# Altium schematic sheet Analog_Frontend02.SchDoc
size A4; DocumentNumber: 3; SheetNumber: 2; SheetTotal: 5
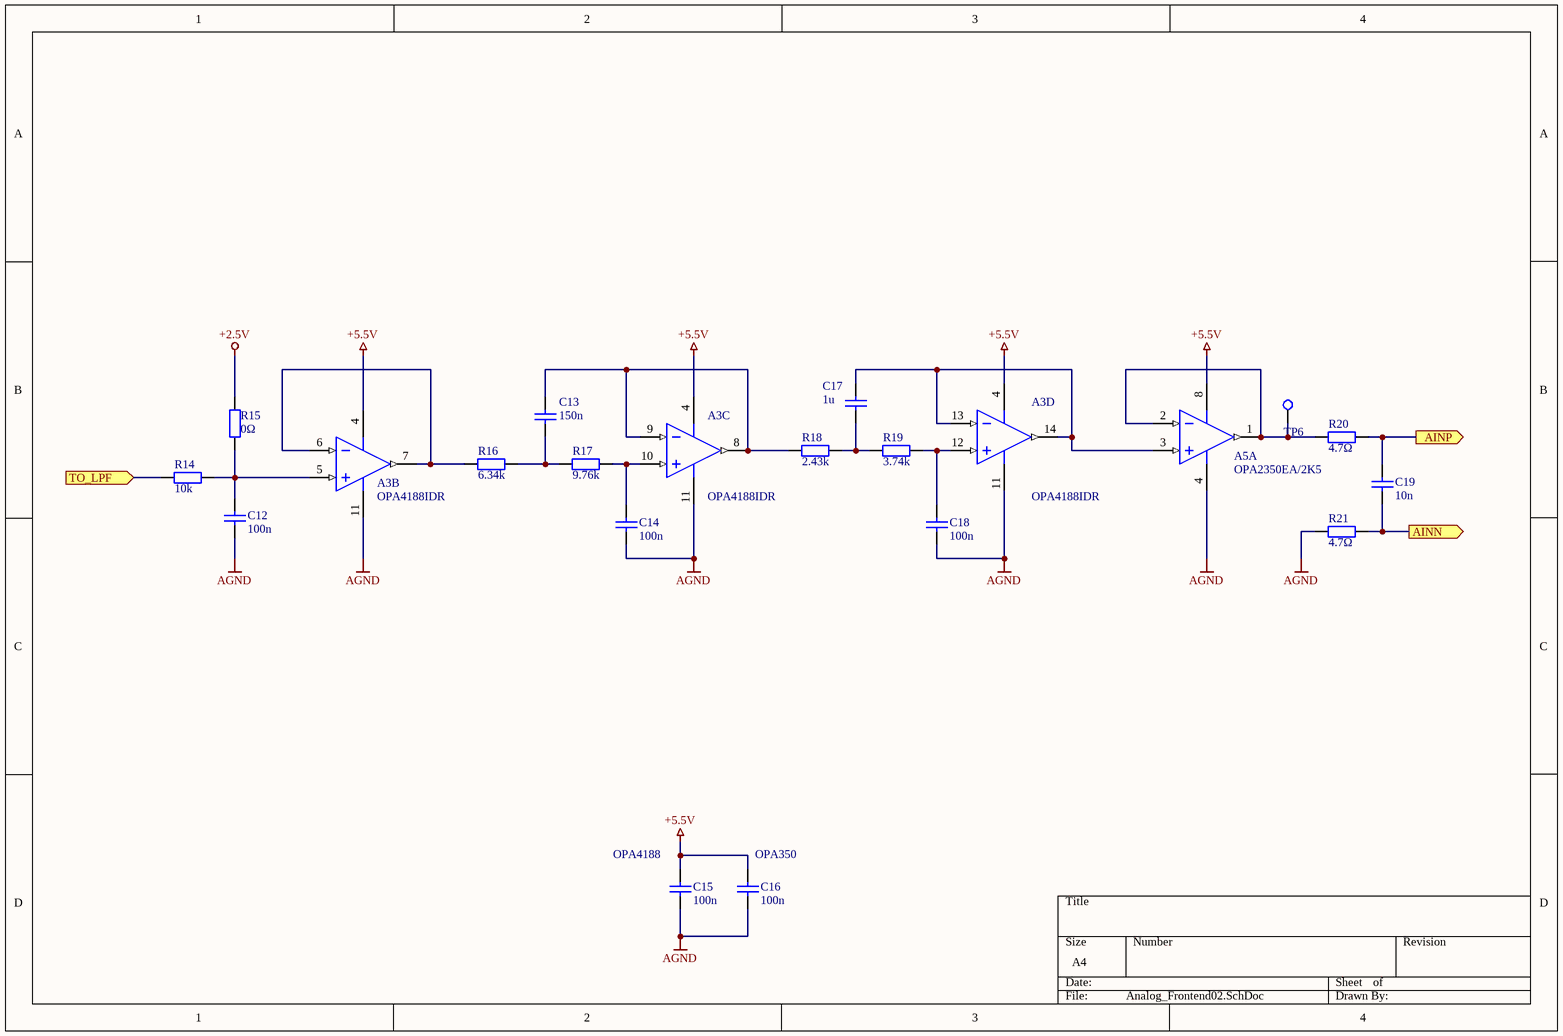
[diagram p0: Analog_Frontend02.SchDoc]

## Parts
A3  OPA4188IDR  [SOIC127P600X175-14N]  (parts B,C,D of 4)
A5  OPA2350EA/2K5  [SOIC127P600X175-8N]  (part A of 2)
C12  100n  [CAPC1608X87N]
C13  150n  [CAPC1608X87N]
C14  100n  [CAPC1608X87N]
C15  100n  [CAPC1608X87N]
C16  100n  [CAPC1608X87N]
C17  1u  [CAPC1608X87N]
C18  100n  [CAPC1608X87N]
C19  10n  [CAPC1608X87N]
R14  10k  [RESC1608X55N]
R15  0Ω  [RESC1608X55N]
R16  6.34k  [RESC1608X55N]
R17  9.76k  [RESC1608X55N]
R18  2.43k  [RESC1608X55N]
R19  3.74k  [RESC1608X55N]
R20  4.7Ω  [RESC1608X55N]
R21  4.7Ω  [RESC1608X55N]
TP6  TP  [TEST-POINT]  (value not drawn)  (no BOM)

## Ports
AINN (out), AINP (out), TO_LPF (in)

## Nets
+2.5V: R15.2
+5.5V: A3.4(+V) A5.8(V+) C15.2 C16.2
AGND: A3.11(-V) A5.4(V-) C12.1 C14.1 C15.1 C16.1 C18.1 R21.1
AINN: C19.1 R21.2 ; port AINN
AINP: C19.2 R20.2 ; port AINP
TO_LPF: R14.1 ; port TO_LPF
NetA3_5: A3.5(+IN_B) C12.2 R14.2 R15.1
NetA3_6: A3.6(-IN_B) A3.7(OUT_B) R16.1
NetA3_8: A3.8(OUT_C) A3.9(-IN_C) C13.2 R18.1
NetA3_10: A3.10(+IN_C) C14.2 R17.2
NetA3_12: A3.12(+IN_D) C18.2 R19.2
NetA3_13: A3.13(-IN_D) A3.14(OUT_D) A5.3(IN_A+) C17.2
NetA5_1: A5.1(OUT_A) A5.2(IN_A-) R20.1 TP6.0
NetC13_1: C13.1 R16.2 R17.1
NetC17_1: C17.1 R18.2 R19.1

## Notes on the sheet
- (near C15) OPA4188
- (near C16) OPA350

## Library data of the parts
A3 = AD824ARZ-14-3V-RL: Manufacturer 1: Texas Instruments; Manufacturer Part Number 1: OPA4188IDR
A5 = OPA2350EA/250: Manufacturer 1: Texas Instruments; Manufacturer Part Number 1: OPA2350EA/2K5
C12 C14-C16 C18 = Cap: Manufacturer 1: Taiyo Yuden; Manufacturer Part Number 1: EMK107B7104KA-T
C13 = Cap: Manufacturer 1: Samsung Electro-Mechanics; Manufacturer Part Number 1: CL10B154KO8NNNC
C17 = Cap: Manufacturer 1: Taiyo Yuden; Manufacturer Part Number 1: EMK107BJ105KA-T
C19 = Cap: Manufacturer 1: KEMET; Manufacturer Part Number 1: C0603C103J4RACAUTO
R14 = Res2: Manufacturer 1: Yageo; Manufacturer Part Number 1: RC0603FR-0710KL; MOUSER Part Number: 603-RC0603FR-0710KL
R15 = Res2: Manufacturer 1: Panasonic; Manufacturer Part Number 1: ERJ-3GEY0R00V
R16 = Res2: Manufacturer 1: Vishay/Dale; Manufacturer Part Number 1: CRCW06036K34FKEA
R17 = Res2: Manufacturer 1: Vishay/Dale; Manufacturer Part Number 1: CRCW06039K76FKEA
R18 = Res2: Manufacturer 1: Vishay/Dale; Manufacturer Part Number 1: CRCW06032K43FKEA
R19 = Res2: Manufacturer 1: Vishay/Dale; Manufacturer Part Number 1: CRCW06033K74FKEA
R20 R21 = Res2: Manufacturer 1: Vishay/Dale; Manufacturer Part Number 1: CRCW06034R70FKEAC
TP6 = TEST_POINT: Generic test point